# EAGLE design Projeto_Temperatura (EAGLE 9.6.2)
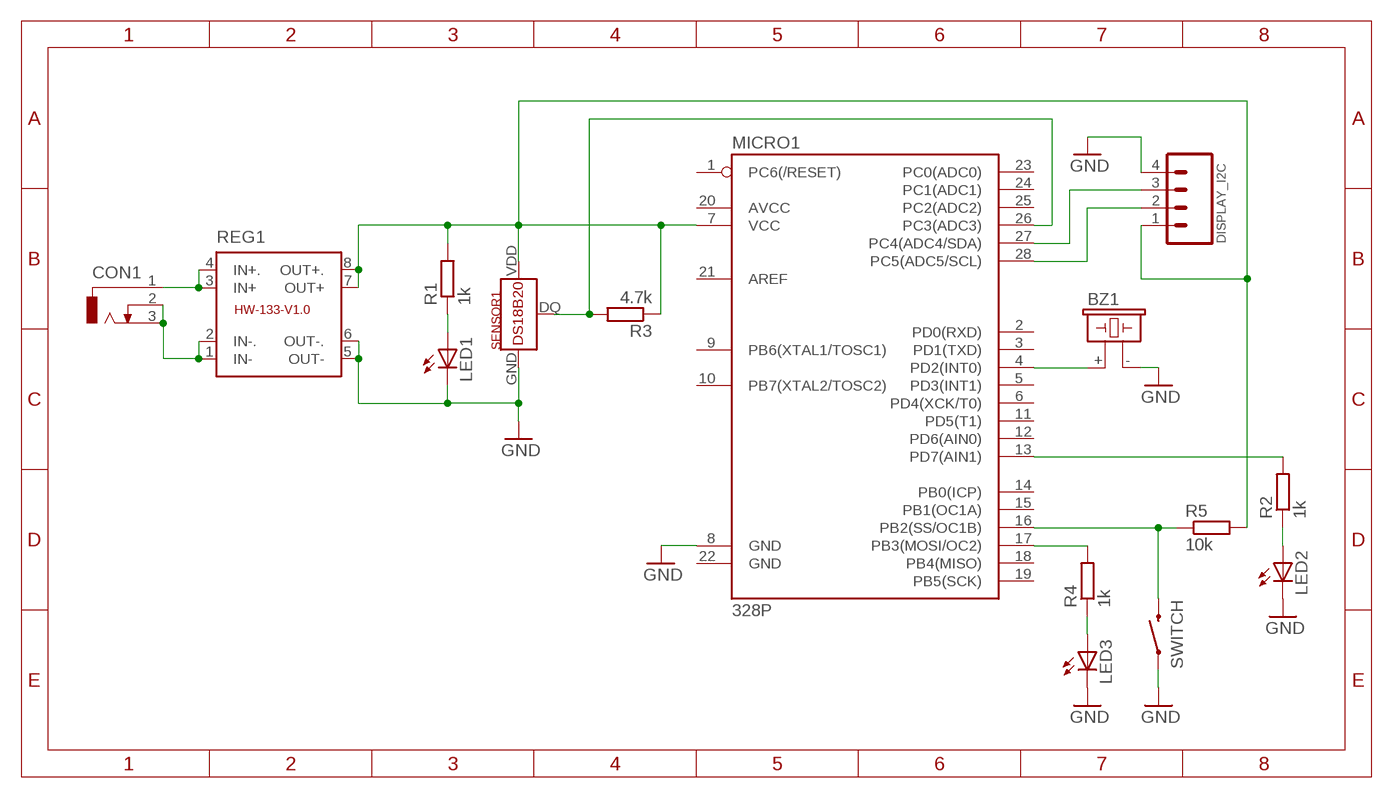
[diagram p0: schematic, sheet 1]

## Parts
BZ1  F/CM12P  [F/CM12P]
CON1  DCJ0202  [DCJ0202]
DISPLAY_I2C  MA04  [04PA]
LED1  LED5MM  [LED5MM]
LED2  LED5MM  [LED5MM]
LED3  LED5MM  [LED5MM]
MICRO1  328P  ATMEGA328P_PDIP  [DIP28]
R1  1k  R-EU_0204/7  [0204/7]
R2  1k  R-EU_0204/7  [0204/7]
R3  4.7k  R-EU_0204/7  [0204/7]
R4  1k  R-EU_0204/7  [0204/7]
R5  10k  R-EU_0204/7  [0204/7]
REG1  REGULADOR  [REGULADOR]
SENSOR1  DS18B20  [TO-92]
SWITCH  MOMENTARY-SWITCH-SPST-PTH-RIGHT-ANGLE-KIT  [TACTILE_SWITCH_PTH_RIGHT_ANGLE_KIT]

## Nets
GND: BZ1.- DISPLAY_I2C.4 LED1.K(C) LED2.K(C) LED3.K(C) MICRO1.8(GND) REG1.5(OUT-) REG1.6(OUT-.) SENSOR1.GND SWITCH.1
N$1: LED2.A R2.1
N$2: MICRO1.13(PD7(AIN1)) R2.2
N$3: LED1.A R1.1
N$5: LED3.A R4.1
N$6: MICRO1.26(PC3(ADC3)) R3.2 SENSOR1.DQ
N$7: MICRO1.17(PB3(MOSI/OC2)) R4.2
N$8: BZ1.+ MICRO1.4(PD2(INT0))
N$9: MICRO1.16(PB2(SS/OC1B)) R5.1 SWITCH.2
N$10: DISPLAY_I2C.3 MICRO1.27(PC4(ADC4/SDA))
N$11: DISPLAY_I2C.2 MICRO1.28(PC5(ADC5/SCL))
N$12: DISPLAY_I2C.1 MICRO1.7(VCC) R1.2 R3.1 R5.2 REG1.7(OUT+) REG1.8(OUT+.) SENSOR1.VDD
N$14: CON1.1 REG1.3(IN+) REG1.4(IN+.)
N$15: CON1.2 CON1.3 REG1.1(IN-) REG1.2(IN-.)
Unconnected: MICRO1.1(PC6(/RESET)) MICRO1.2(PD0(RXD)) MICRO1.3(PD1(TXD)) MICRO1.5(PD3(INT1)) MICRO1.6(PD4(XCK/T0)) MICRO1.9(PB6(XTAL1/TOSC1)) MICRO1.10(PB7(XTAL2/TOSC2)) MICRO1.11(PD5(T1)) MICRO1.12(PD6(AIN0)) MICRO1.14(PB0(ICP)) MICRO1.15(PB1(OC1A)) MICRO1.18(PB4(MISO)) MICRO1.19(PB5(SCK)) MICRO1.20(AVCC) MICRO1.21(AREF) MICRO1.22(GND) MICRO1.23(PC0(ADC0)) MICRO1.24(PC1(ADC1)) MICRO1.25(PC2(ADC2))

## Notes on the sheet
- REG1

## Library data of the parts
BZ1 = buzzer:F/CM12P: BUZZER Source: Buerklin; OC_FARNELL: unknown; OC_NEWARK: unknown
CON1 = con-jack:DCJ0202: DC POWER JACK Source: DCJ0202.pdf; OC_FARNELL: unknown; OC_NEWARK: unknown
DISPLAY_I2C = con-amp-quick:MA04: AMP QUICK CONNECTOR; OC_FARNELL: unknown; OC_NEWARK: unknown
LED1-LED3 = adafruit:LED: LED OSRAM: - CHIPLED LG R971, LG N971, LY N971, LG Q971, LY Q971, LO R971, LY R971 LH N974, LH R974 LS Q976, LO Q976, LY Q976 LO Q996 - Hyper CHIPLED LW Q18S LB Q993, LB Q99A, LB R99A - SideLED LS A670, LO A670, LY A670, LG A670, LP A670 LB A673, LV A673, LT A673, LW A673 LH A674 LY A675 LS A676, LA A676, LO A676, LY A676, LW A676 LS A679, LY A679, LG A679 - Hyper Micro SIDELED® LS Y876, LA Y876, LO Y876, LY Y876 LT Y87S - SmartLED LW L88C, LW L88S LB L89C, LB L89S, LG L890 LS L89K, LO L89K, LY L89K LS L896, LA L896, LO L896, LY L896 - TOPLED LS T670, LO T670, LY T670, LG T670, LP T670 LSG T670, LSP T670, LSY T670, LOP T670, LYG T670 LG T671, LOG T671, LSG T671 LB T673, LV T673, LT T673, LW T673 LH T674 LS T676, LA T676, LO T676, LY T676, LB T676, LH T676, LSB T676, LW T676 LB T67C, LV T67C, LT T67C, LS T67K, LO T67K, LY T67K, LW E67C LS E67B, LA E67B, LO E67B, LY E67B, LB E67C, LV E67C, LT E67C LW T67C LS T679, LY T679, LG T679 LS T770, LO T770, LY T770, LG T770, LP T770 LB T773, LV T773, LT T773, LW T773 LH T774 LS E675, LA E675, LY E675, LS T675 LS T776, LA T776, LO T776, LY T776, LB T776 LHGB T686 LT T68C, LB T68C - Hyper Mini TOPLED® LB M676 - Mini TOPLED Santana® LG M470 LS M47K, LO M47K, LY M47K Source: http://www.osram.convergy.de/
MICRO1 = SparkFun-IC-Microcontroller:ATMEGA328P_PDIP: Atmel 328P Through hole ATMEGA328P uC used in the Arduino 32kb flash, 1k EEPROM, 2k SRAM Datasheet <http://www.sparkfun.com/datasheets/Components/SMD/ATMega328.pdf> SparkFun Products Storefront component: AVR 28 Pin 20MHz 32K 6A/D - ATMega328P <https://www.sparkfun.com/products/9061> (COM-09061) SparkFun Simon Says - Through-Hole Soldering Kit <https://www.sparkfun.com/products/10547> (KIT-10547) SparkFun Learn to Solder - Simon Says <https://www.sparkfun.com/products/13708> (KIT-13708) SparkFun BigTime Watch Kit <https://www.sparkfun.com/products/11734> (KIT-11734) SparkFun ClockIt <https://www.sparkfun.com/products/10930> (KIT-10930) SparkFun Serial Enabled LCD Kit <https://www.sparkfun.com/products/10097> (LCD-10097) SparkFun Simon Tilts - Through Hole Soldering Kit <https://www.sparkfun.com/products/12634> (KIT-12634) SparkFun Frequency Counter Kit <https://www.sparkfun.com/products/10140> (KIT-10140) FabFM Radio Kit <https://www.sparkfun.com/products/11043> (KIT-11043) SparkFun Binary Blaster Kit <https://www.sparkfun.com/products/12037> (KIT-12037) SparkFun Metro-Gnome <https://www.sparkfun.com/products/9236> (KIT-09236) ATmega328 with Arduino Optiboot (Uno) <https://www.sparkfun.com/products/10524> (DEV-10524); PROD_ID: IC-09136
R1-R5 = rcl:R-EU_: RESISTOR, European symbol; SPICEPREFIX: R
REG1 = ReguladoresTensao:REGULADOR
SENSOR1 = Projeto1:DS18B20: The DS18B20 digital thermometer provides 9-bit to 12-bit Celsius temperature measurements and has an alarm function with nonvolatile user-programmable upper and lower trigger points. The DS18B20 communicates over a 1-Wire bus that by definition requires only one data line (and ground) for communication with a central microprocessor. In addition, the DS18B20 can derive power directly from the data line (“parasite power”), eliminating the need for an external power supply.
SWITCH = SparkFun-Switches:MOMENTARY-SWITCH-SPST: Momentary Switch (Pushbutton) - SPST Normally-open (NO) SPST momentary switches (buttons, pushbuttons). Variants PTH-12MM - 12mm square, through-hole Momentary Pushbutton Switch - 12mm Square <https://www.sparkfun.com/products/9190> (COM-09190) PTH-6.0MM, PTH-6.0MM-KIT - 6.0mm square, through-hole Mini Pushbutton Switch <https://www.sparkfun.com/products/97> (COM-00097) KIT package intended for soldering kit's - only one side of pads' copper is exposed. PTH-RIGHT-ANGLE-KIT - Right-angle, through-hole Right Angle Tactile Button <https://www.sparkfun.com/products/10791> - Used on SparkFun BigTime Watch Kit <https://www.sparkfun.com/products/11734> SMD-12MM - 12mm square, surface-mount Tactile Button - SMD (12mm) <https://www.sparkfun.com/products/12993> (COM-12993) Used on SparkFun PicoBoard <https://www.sparkfun.com/products/11888> SMD-4.5MM - 4.5mm Square Trackball Switch Used on SparkFun Blackberry Trackballer Breakout <https://www.sparkfun.com/products/13169> SMD-4.6MMX2.8MM - 4.60mm x 2.80mm, surface mount Used on SparkFun SAMD21 Mini Breakout <https://www.sparkfun.com/products/13664> SMD-5.2MM, SMD-5.2-REDUNDANT - 5.2mm square, surface-mount Mini Pushbutton Switch - SMD <https://www.sparkfun.com/products/8720> (COM-08720) Used on Arduino Pro Mini <https://www.sparkfun.com/products/11114> REDUNDANT package connects both switch circuits together SMD-6.0X3.5MM - 6.0 x 3.5mm, surface mount Momentary Reset Switch SMD <https://www.sparkfun.com/products/8229> (COM-08229) SMD-6.2MM-TALL - 6.2mm square, surface mount Tactile Button - SMD (6mm) <https://www.sparkfun.com/products/12992> Used on SparkFun Digital Sandbox <https://www.sparkfun.com/products/12651> SMD-RIGHT-ANGLE - Right-angle, surface mount Used on SparkFun Block for Intel® Edison - Arduino <https://www.sparkfun.com/products/13036>; PROD_ID: CONN-10672; SF_SKU: COM-10791

## Board
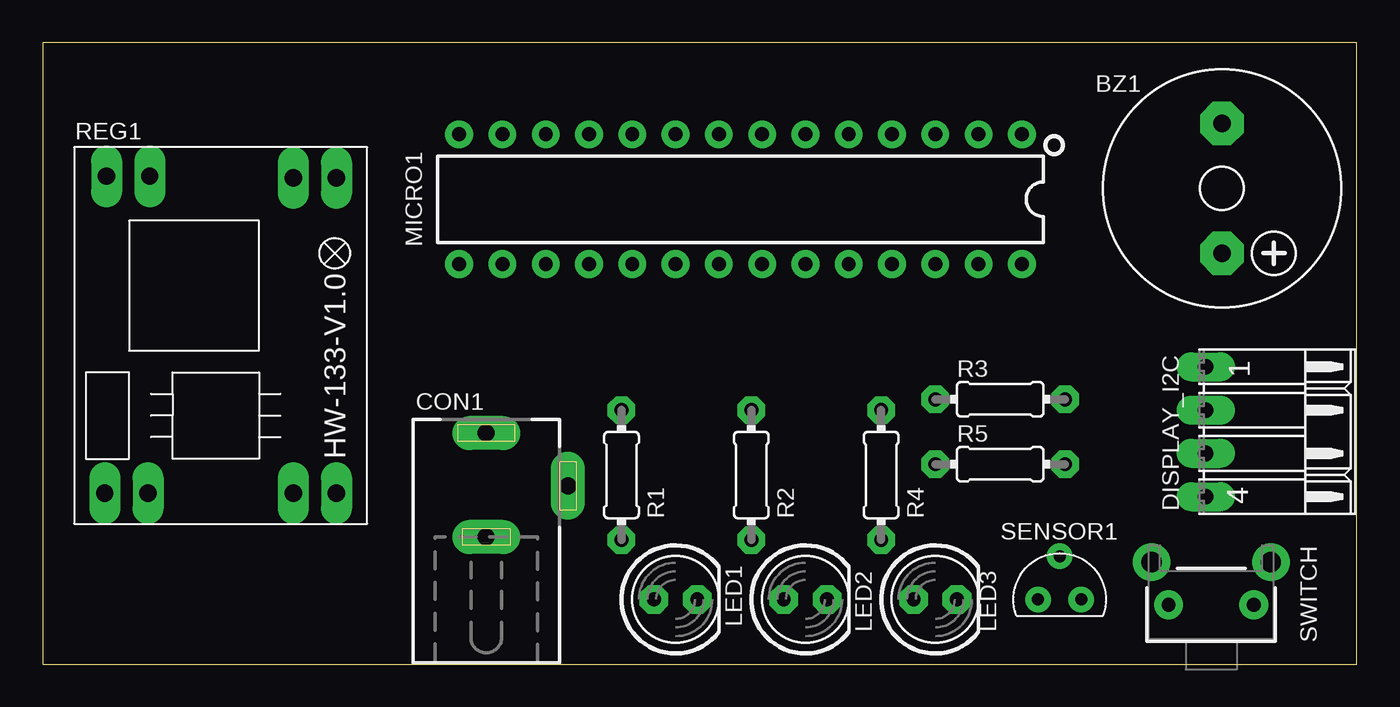
[diagram p1: board, top side]
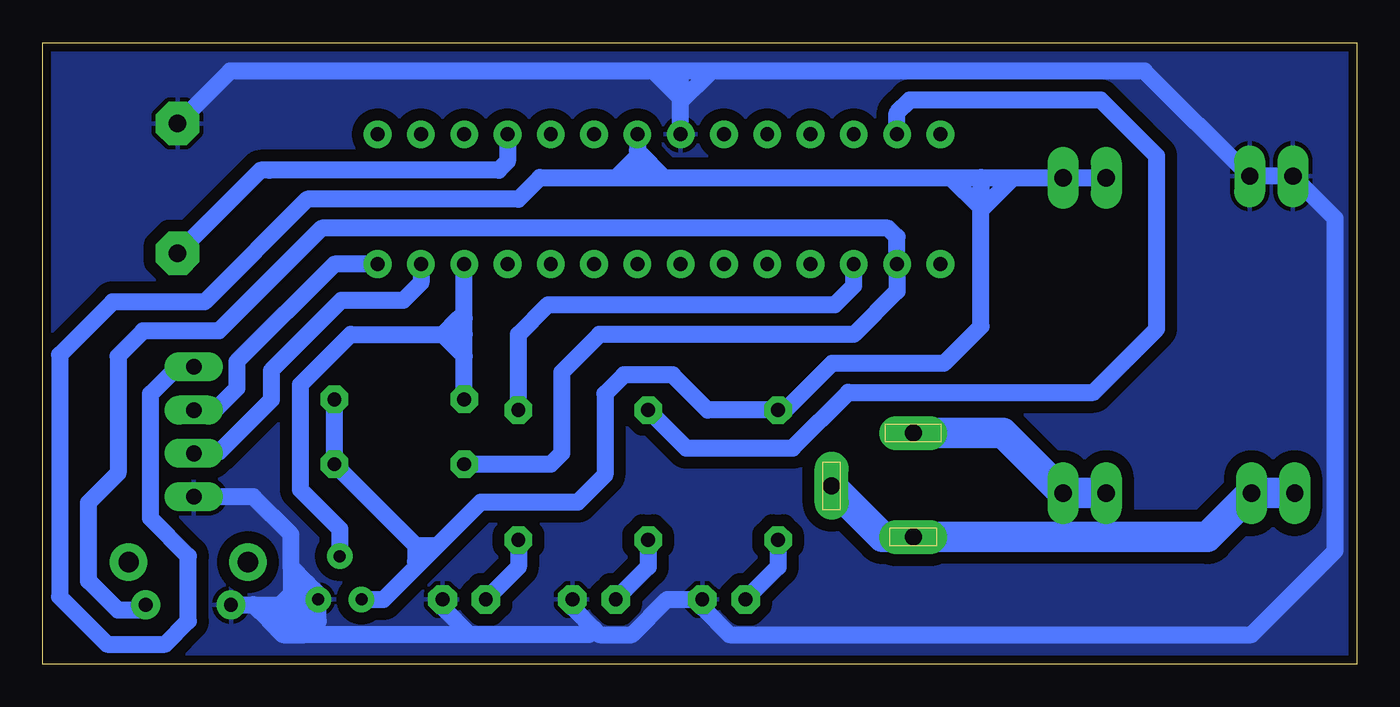
[diagram p2: board, bottom side, seen from below]

Size 77.13 x 36.5 mm. Coordinates in mm from the lower left corner, seen from the top.
Outline: 0,0 77.13,0 77.13,36.5 0,36.5 0,0
Copper layers (1*16): Top 0.035mm / dielectric 1.5mm / Bottom 0.035mm
Design rules "default *": minimum track width 1mm, minimum drill 0.5mm, track to track 0.7mm, track to pad 0.7mm, pad to pad 0.7mm, via to via 0.7mm, smd to smd 0.7mm, copper to edge 0.5mm, drill to drill 6mil, minimum pad ring 0.4mm, minimum via ring 0.4mm, stop-mask expansion 4mil, vias tented up to drill 0mil, thermal gap 10mil

### Footprints (pad centres in the part's own frame; a part is rotated, then mirrored left to right if it is on the bottom)
F/CM12P = drill 1.016 pad 2.54 octagon: + 3.81,0; - -3.81,0
DCJ0202 = drill 1 pad 2 long: 1 0,3.1; 2 4.8,0; 3 0,-3
04PA = drill 0.914 long: 1 -3.81,0; 2 -1.27,0; 3 1.27,0; 4 3.81,0
LED5MM = drill 0.813 pad 1.676 octagon: A -1.27,0; K 1.27,0
DIP28 = drill 0.813 pad 1.626: 1 -16.51,-3.81; 2 -13.97,-3.81; 3 -11.43,-3.81; 4 -8.89,-3.81; 5 -6.35,-3.81; 6 -3.81,-3.81; 7 -1.27,-3.81; 8 1.27,-3.81; 9 3.81,-3.81; 10 6.35,-3.81; 11 8.89,-3.81; 12 11.43,-3.81; 13 13.97,-3.81; 14 16.51,-3.81; 15 16.51,3.81; 16 13.97,3.81; 17 11.43,3.81; 18 8.89,3.81; 19 6.35,3.81; 20 3.81,3.81; 21 1.27,3.81; 22 -1.27,3.81; 23 -3.81,3.81; 24 -6.35,3.81; 25 -8.89,3.81; 26 -11.43,3.81; 27 -13.97,3.81; 28 -16.51,3.81
0204/7 = drill 0.813 octagon: 1 -3.81,0; 2 3.81,0
REGULADOR = drill 1.016 long: 1 1.8,15.4; 2 1.8,12.86; 3 1.8,4.34; 4 1.8,1.8; 5 20.4,15.3; 6 20.4,12.76; 7 20.3,4.34; 8 20.3,1.8
TO-92 = drill 0.7: DQ 0,2.54; GND 1.27,0; VDD -1.27,0
TACTILE_SWITCH_PTH_RIGHT_ANGLE_KIT = drill 0.8 pad 1.7: 1 -2.5,0; 2 2.5,0 | drill 1.2 pad 2.2: ANCHOR1 -3.5,2.5; ANCHOR2 3.5,2.5

### Placement (x,y rotation side)
BZ1  69.22,27.94 270 top
CON1  26.04,10.48 0 top
DISPLAY_I2C  68.26,13.65 270 top
LED1  37.15,3.81 0 top
LED2  44.77,3.81 0 top
LED3  52.39,3.81 0 top
MICRO1  40.96,27.3 180 top
R1  33.97,11.11 90 top
R2  41.59,11.11 90 top
R3  56.2,15.56 180 top
R4  49.21,11.11 90 top
R5  56.2,11.75 0 top
REG1  19.05,8.26 90 top
SENSOR1  59.69,3.81 0 top
SWITCH  68.58,3.49 0 top

### Tracks (layer width: path | path; a pad name or v marks a point on that pad's centre or on a via)
GND
  Bottom 1: 44.77,2.06 46.04,3.33 LED2.K | 44.77,2.06 44.45,1.75 42.55,1.75 40.48,3.81 LED1.K 38.42,3.33 36.83,1.75 6.19,1.75 1.27,6.67 1.27,26.18 REG1.5 REG1.6 12.46,34.83 37.88,34.83 | LED3.K 53.66,3.33 52.07,1.75 | 52.07,1.75 45.09,1.75 44.77,2.06 | SENSOR1.GND 60.96,2.54 62.23,2.54 | 52.07,1.75 61.75,1.75 | 37.88,34.83 39.69,34.83 | 39.69,34.83 41.28,34.83 | MICRO1.8 39.69,33.02 | 39.69,33.24 39.69,34.83 | 39.69,33.02 37.88,34.83 | 39.69,33.02 39.69,33.24 | 39.69,33.24 41.28,34.83 | SWITCH.1 64.77,3.49 | 64.77,3.49 63.82,2.54 | 62.55,2.54 62.23,2.54 | 62.23,2.54 SENSOR1.GND | 62.55,2.54 63.82,2.54 | 62.55,2.54 61.75,1.75 | BZ1.- 66.14,34.83 41.28,34.83 | DISPLAY_I2C.4 64.77,9.84 62.55,7.62 62.55,5.71 | SENSOR1.GND 60.96,4.13 61.59,4.76 | 61.59,4.76 62.55,5.71 | 62.55,5.71 62.55,4.13 63.18,3.49 | 63.18,3.49 63.5,3.17 | 61.59,4.76 62.55,3.81 | 62.55,2.54 62.55,3.81 | SENSOR1.GND 62.55,3.81 | 63.82,2.54 63.02,1.75 61.75,1.75 | 64.77,3.49 63.18,3.49
  pour Bottom: 0,36.51 77.15,36.51 77.15,0 0,0
N$1
  Bottom 1: R2.1 41.59,5.71 LED2.A
N$2
  Bottom 1: R2.2 39.37,12.7 33.11,12.7 29.85,15.97 15.46,15.97 11.75,19.68 11.75,29.84 15.03,33.13 26.24,33.13 26.99,32.38 MICRO1.13
N$3
  Bottom 1: R1.1 33.97,5.71 LED1.A
N$5
  Bottom 1: R4.1 49.21,5.71 LED3.A
N$6
  Bottom 1: R3.2 52.39,18.1 | 52.39,18.1 52.39,19.37 | 52.39,19.37 52.39,20.32 | 52.39,20.32 MICRO1.26 | SENSOR1.DQ 59.69,7.94 62.01,10.26 62.01,16.41 59.05,19.37 53.66,19.37 | 53.66,19.37 52.39,19.37 | 52.39,18.1 53.66,19.37 | 53.66,19.37 52.7,20.32 52.39,20.32
N$7
  Bottom 1: R4.2 49.21,19.37 47.47,21.11 30.64,21.11 29.53,22.23 MICRO1.17
N$8
  Bottom 1: MICRO1.4 49.85,29.53 50.37,29 63.82,29 64.34,29 BZ1.+
N$9
  Bottom 1: R5.1 47.31,11.75 46.67,12.38 46.67,17.14 44.45,19.37 29.53,19.37 26.99,21.91 MICRO1.16 26.99,25.08 27.51,25.61 60.75,25.61 66.79,19.57 71.23,19.57 72.71,18.1 72.71,11.22 74.43,9.5 74.43,4.9 72.71,3.17 71.44,3.17 71.12,3.49 SWITCH.2
N$10
  Bottom 1: MICRO1.27 54.93,22.41 55.97,21.36 59.6,21.36 63.72,17.25 63.72,15.52 66.76,12.48 68.16,12.48 DISPLAY_I2C.3
N$11
  Bottom 1: DISPLAY_I2C.2 67.01,14.92 65.73,16.2 65.73,17.77 60.01,23.5 MICRO1.28
N$12
  Bottom 1: 22.07,28.57 22.07,26.81 | 22.07,26.67 22.07,19.84 24.24,17.67 30.8,17.67 33.54,14.92 R1.2 38.1,14.92 40.16,16.99 43.02,16.99 44.13,15.88 44.13,11.11 45.73,9.52 51.42,9.52 53.95,6.99 | SENSOR1.VDD 57.13,3.81 55.08,5.86 | 55.08,5.86 54.6,6.34 | 54.6,6.34 53.95,6.99 | MICRO1.7 42.23,30.8 | R3.1 R5.2 55.24,6.99 | DISPLAY_I2C.1 69.22,17.46 70.8,15.88 70.8,8.57 68.58,6.35 68.58,2.54 69.94,1.18 73.34,1.18 76.13,3.97 76.13,18.16 73.02,21.27 67.63,21.27 61.59,27.3 49.21,27.3 47.94,28.57 47.92,28.55 43.5,28.55 | 54.6,6.34 55.24,6.99 | 55.24,6.99 53.95,6.99 | 55.24,6.99 55.24,6.03 55.08,5.86 | REG1.7 REG1.8 20.18,28.55 | 20.18,28.55 23.81,28.55 | 22.07,26.67 20.18,28.55 | 22.07,26.67 22.07,26.81 | 22.07,26.81 23.81,28.55 | 23.81,28.55 40.62,28.55 | 40.62,28.55 42.23,28.55 | 42.23,28.55 43.5,28.55 | MICRO1.7 42.23,28.55 | MICRO1.7 42.23,30.16 40.62,28.55 | MICRO1.7 42.23,29.82 43.5,28.55
N$14
  Bottom 1.778: CON1.1 20.77,13.58 REG1.4 REG1.3
N$15
  Bottom 1.778: REG1.1 REG1.2 8.77,7.48 CON1.3 27.84,7.48 CON1.2

### Text on the board
tNames: BZ1 | REG1